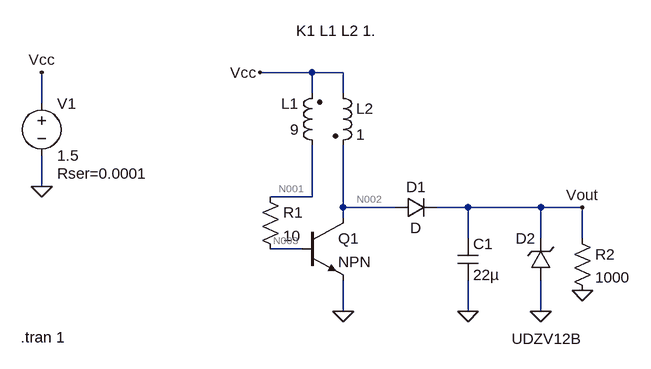
[diagram p0: schematic joule_thief.asc]
joule_thief.asc, the LTspice schematic file:
Version 4
SHEET 1 880 680
WIRE 176 80 96 80
WIRE 224 80 176 80
WIRE 176 112 176 80
WIRE 224 112 224 80
WIRE -240 128 -240 80
WIRE -240 256 -240 208
WIRE 176 272 176 192
WIRE 176 272 112 272
WIRE 224 288 224 192
WIRE 304 288 224 288
WIRE 416 288 368 288
WIRE 528 288 416 288
WIRE 592 288 528 288
WIRE 224 304 224 288
WIRE 416 336 416 288
WIRE 528 336 528 288
WIRE 592 336 592 288
WIRE 160 352 112 352
WIRE 224 448 224 400
WIRE 416 448 416 400
WIRE 528 448 528 400
FLAG -240 256 0
FLAG -240 80 Vcc
FLAG 96 80 Vcc
FLAG 224 448 0
FLAG 592 288 Vout
FLAG 592 416 0
FLAG 416 448 0
FLAG 528 448 0
SYMBOL ind2 192 208 R180
WINDOW 0 36 80 Left 2
WINDOW 3 36 40 Left 2
SYMATTR InstName L1
SYMATTR Value 9
SYMBOL ind2 208 96 R0
SYMATTR InstName L2
SYMATTR Value 1
SYMBOL voltage -240 112 R0
WINDOW 123 0 0 Left 0
WINDOW 39 24 124 Left 2
SYMATTR SpiceLine Rser=0.0001
SYMATTR InstName V1
SYMATTR Value 1.5
SYMBOL res 96 256 R0
SYMATTR InstName R1
SYMATTR Value 10
SYMBOL npn 160 304 R0
SYMATTR InstName Q1
SYMBOL res 576 320 R0
SYMATTR InstName R2
SYMATTR Value 1000
SYMBOL diode 304 304 R270
WINDOW 0 32 32 VTop 2
WINDOW 3 0 32 VBottom 2
SYMATTR InstName D1
SYMBOL cap 400 336 R0
SYMATTR InstName C1
SYMATTR Value 22µ
SYMBOL zener 544 400 R180
WINDOW 0 24 64 Left 2
WINDOW 3 -47 -90 Left 2
SYMATTR InstName D2
SYMATTR Value UDZV12B
TEXT 152 16 Left 2 !K1 L1 L2 1.
TEXT -272 488 Left 2 !.tran 1

The netlist it stands for:
* joule_thief.asc
L1 N001 Vcc 9
L2 Vcc N002 1
V1 Vcc 0 1.5 Rser=0.0001
R1 N001 N003 10
Q1 N002 N003 0 0 NPN
R2 Vout 0 1000
D1 N002 Vout D
C1 Vout 0 22µ
D2 0 Vout UDZV12B
.model D D
.lib standard.dio
.model NPN NPN
.model PNP PNP
.lib standard.bjt
K1 L1 L2 1.
.tran 1
.backanno
.end

* Results of the author's LTspice run, read from the files saved beside the schematic
* Operating Point, zero values left out:
*   V(n001) = 1.499 V
*   V(vcc) = 1.499 V
*   V(n002) = 1.499 V
*   V(n003) = 994.8 mV
*   V(vout) = 848.6 mV
*   Ic(Q1) = 5.047 A
*   Ib(Q1) = 50.47 mA
*   Ie(Q1) = -5.098 A
*   I(D2) = -1.864 pA
*   I(D1) = 848.6 µA
*   I(L2) = 5.048 A
*   I(L1) = -50.47 mA
*   I(R2) = 848.6 µA
*   I(R1) = 50.47 mA
*   I(V1) = -5.099 A